# Altium schematic sheet GTM_BallGripper.SchDoc
size A4
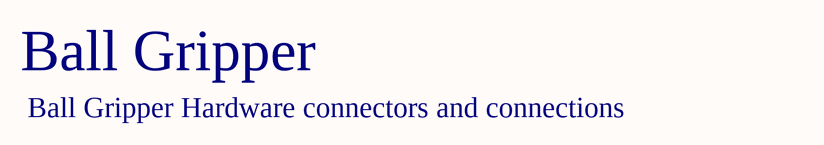
[diagram p0: GTM_BallGripper.SchDoc]

## Notes on the sheet
- Ball Gripper
- Ball Gripper Hardware connectors and connections